# Altium schematic sheet CC LED Driver.SchDoc
size A4; Organization: TESLA Motors, INC; Address1: 3500 Deer Creek Road; Address2: Palo Alto, CA; Address4: U.S.A.; SheetNumber: 18; SheetTotal: 21
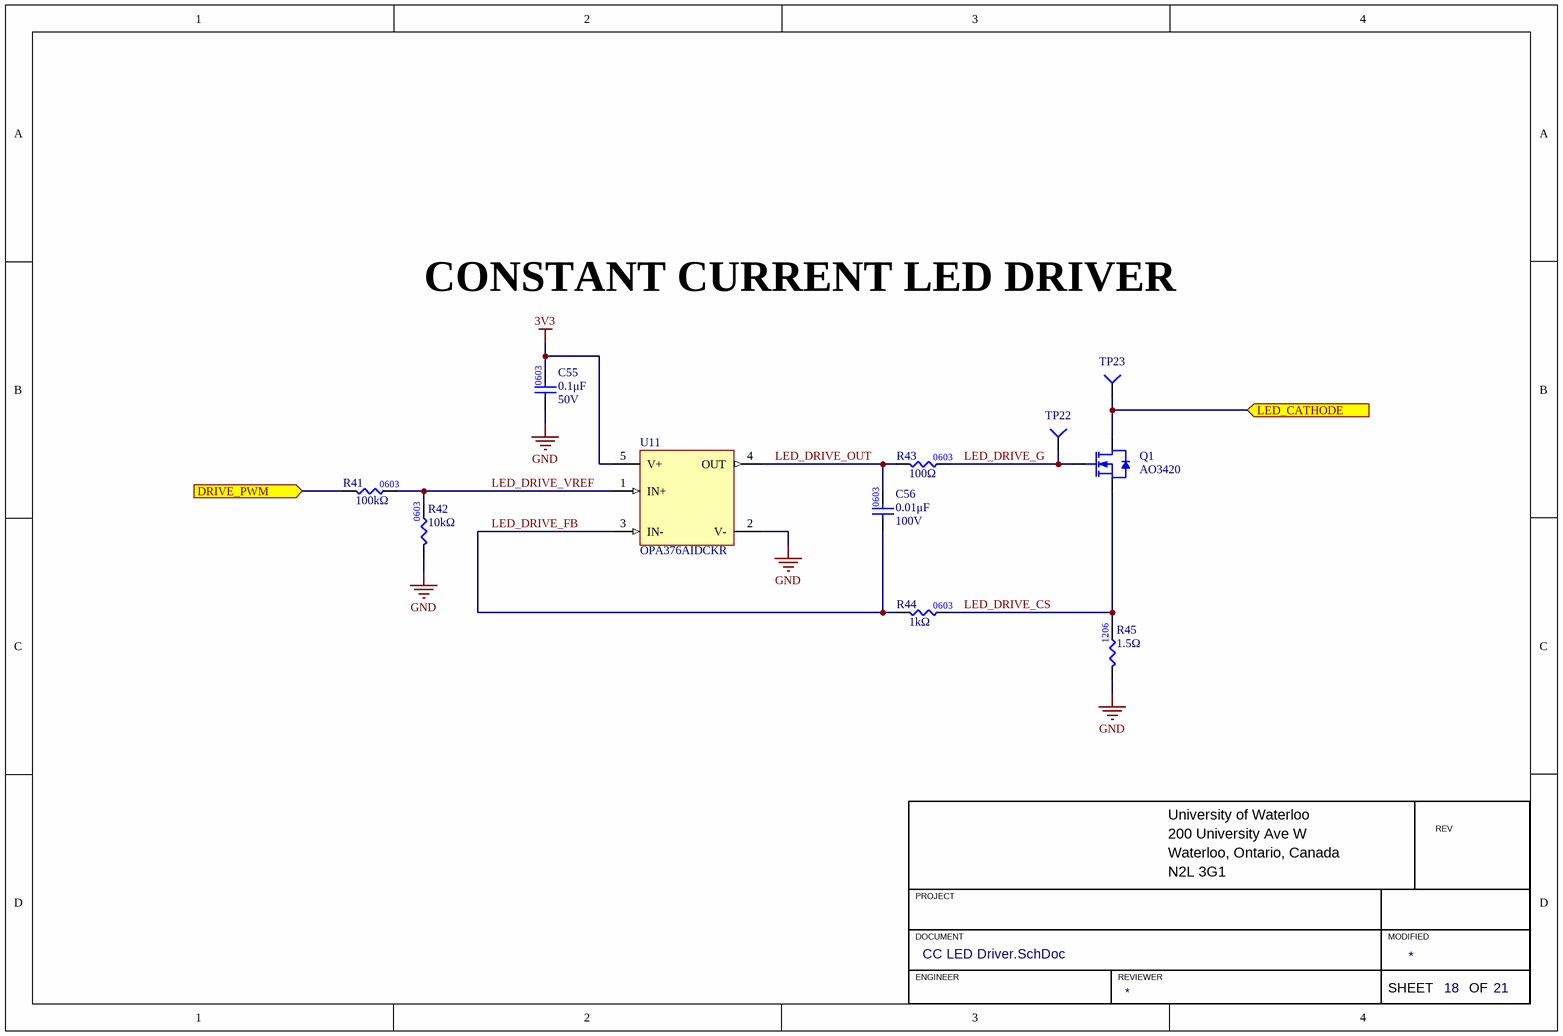
[diagram p0: CC LED Driver.SchDoc]

## Parts
C55  value 0.1μF  Voltage Rating: 50V  [CAP0603]  (hidden comment: CAP_0.1uF_50V_0603)
C56  value 0.01μF  Voltage Rating: 100V  [CAP0603]  (hidden comment: CAP_0.01uF_100V_0603)
Q1  Manufacturer Part Number 1: AO3420  [SOT23-3]  (hidden comment: NMOS_20V_6A)
R41  value 100kΩ  [RES0603]  (hidden comment: RES_100kΩ_0603_1%)
R42  value 10kΩ  [RES0603]  (hidden comment: RES_10kΩ_0603_1%)
R43  value 100Ω  [RES0603]  (hidden comment: RES_100Ω_0603_1%)
R44  value 1kΩ  [RES0603]  (hidden comment: RES_1kΩ_0603_1%)
R45  value 1.5Ω  [RES1206]  (hidden comment: RES_1.5Ω_1206_1%)
TP22  TESTPOINT_1MM_CIRCLE  [TESTPOINT_CIRCLE_1MM]  (value not drawn)  (no BOM)
TP23  TESTPOINT_1MM_CIRCLE  [TESTPOINT_CIRCLE_1MM]  (value not drawn)  (no BOM)
U11  OPA376AIDCKR  [TI_SC-70-5]

## Ports
DRIVE_PWM (in), LED_CATHODE (in)

## Nets
3V3: C55.2 U11.5(V+)
GND: C55.1 R42.1 R45.1 U11.2(V-)
DRIVE_PWM: R41.1 ; port DRIVE_PWM
LED_CATHODE: Q1.3(DRAIN) TP23.1(=value) ; port LED_CATHODE
LED_DRIVE_CS: Q1.2(SOURCE) R44.2 R45.2
LED_DRIVE_FB: C56.1 R44.1 U11.3(IN-)
LED_DRIVE_G: Q1.1(GATE) R43.2 TP22.1(=value)
LED_DRIVE_OUT: C56.2 R43.1 U11.4(OUT)
LED_DRIVE_VREF: R41.2 R42.2 U11.1(IN+)

## Notes on the sheet
- CONSTANT CURRENT LED DRIVER
- University of Waterloo
- 200 University Ave W
- REV
- PROJECT
- Waterloo, Ontario, Canada
- N2L 3G1
- DOCUMENT
- ENGINEER
- REVIEWER
- MODIFIED
- SHEET
- OF
- (in symbol CAP_0.01uF_100V_0603) 0603
- (in symbol RES_100kΩ_0603_1%) 0603
- (in symbol RES_100Ω_0603_1%) 0603

## Library data of the parts
C55 = CAP_0.1uF_50V_0603: CAP CER 0.1UF 50V X7R 0603; Manufacturer Part Number 1: CC0603KRX7R9BB104; Manufacturer 1: Yageo; Package/Footprint: 0603; Supplier Part Number 1: 311-1344-1-ND; Supplier 1: Digi-Key; Mounting Type: SMD; Dielectric: X7R
C56 = CAP_0.01uF_100V_0603: CAP CER 0.01uF 100V X7R 0603; Manufacturer Part Number 1: GCM188R72A103KA37J; Manufacturer 1: Murata Electronics; Supplier Part Number 1: 490-8028-1-ND; Supplier 1: Digi-Key; Dielectric: X7R
Q1 = NMOS_20V_6A: MOSFET N-CH 20V 6A SOT-23; Manufacturer 1: Alpha & Omega; Supplier 1: Digi-Key; Supplier Part Number 1: 785-1014-2-ND
R41 = RES_100kΩ_0603_1%: RES 100K OHM 1% 1/10W 0603; Manufacturer 1: Yageo; Manufacturer Part Number 1: RC0603FR-07100KL; Supplier Part Number 1: 311-100KHRCT-ND; Supplier 1: Digi-Key
R42 = RES_10kΩ_0603_1%: RES 10K OHM 1% 1/8W 0603; Manufacturer 1: Stackpole Electronics Inc; Manufacturer Part Number 1: RNCP0603FTD10K0; Supplier Part Number 1: RNCP0603FTD10K0CT-ND; Supplier 1: Digi-Key; Mounting Type: SMD; Package: 0603
R43 = RES_100Ω_0603_1%: RES 100 OHM 1% 1/10W 0603; Manufacturer 1: Yageo; Manufacturer Part Number 1: RC0603FR-07100RL; Supplier Part Number 1: 311-100HRCT-ND; Supplier 1: Digi-Key
R44 = RES_1kΩ_0603_1%: RES 1K OHM 1% 1/8W 0603; Manufacturer 1: Stackpole Electronics Inc; Manufacturer Part Number 1: RNCP0603FTD1K00; Supplier Part Number 1: RNCP0603FTD1K00CT-ND; Supplier 1: Digi-Key; Mounting Type: SMD; Package: 0603
R45 = RES_1.5Ω_1206_1%: RES 1.5 OHM 1% 1/4W 1206; Manufacturer Part Number 1: RMCF1206FT1R50; Manufacturer 1: Stackpole Electronics Inc; Supplier 1: Digi-Key; Supplier Part Number 1: RMCF1206FT1R50CT-ND; Mounting Type: SMD; Power: 1/4W; Package: 1206; Tolerance: 1%
TP22 TP23 = TESTPOINT_1MM_CIRCLE: TESTPOINT 1MM CIRCLE
U11 = OPA376AIDCKR: IC OPAMP GP 1 CIRCUIT SC70-5; Manufacturer 1: Texas Instruments; Package/Footprint: 5-TSSOP; Operating Temperature: -40°C - 125°C; Supplier 1: Digi-Key; Supplier Part Number 1: 296-35916-1-ND; Manufacturer Part Number 1: OPA376AIDCKR